# Altium schematic sheet main.SchDoc
size A4
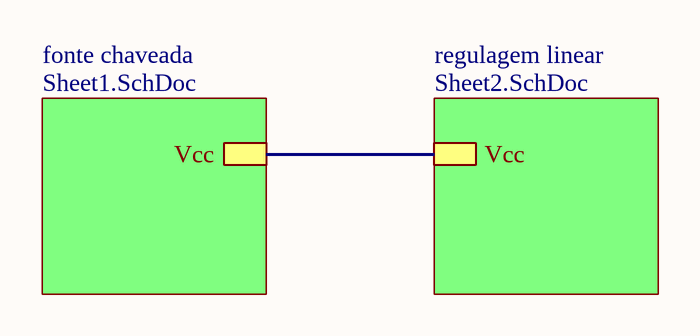
[diagram p0: main.SchDoc]

## Sub-sheets
fonte chaveada = Sheet1.SchDoc: Vcc
regulagem linear = Sheet2.SchDoc: Vcc

## Nets
(unnamed): sheet fonte chaveada/Vcc, sheet regulagem linear/Vcc